# EAGLE design SensorTile_CR2032_V01 (EAGLE 8.6.0)
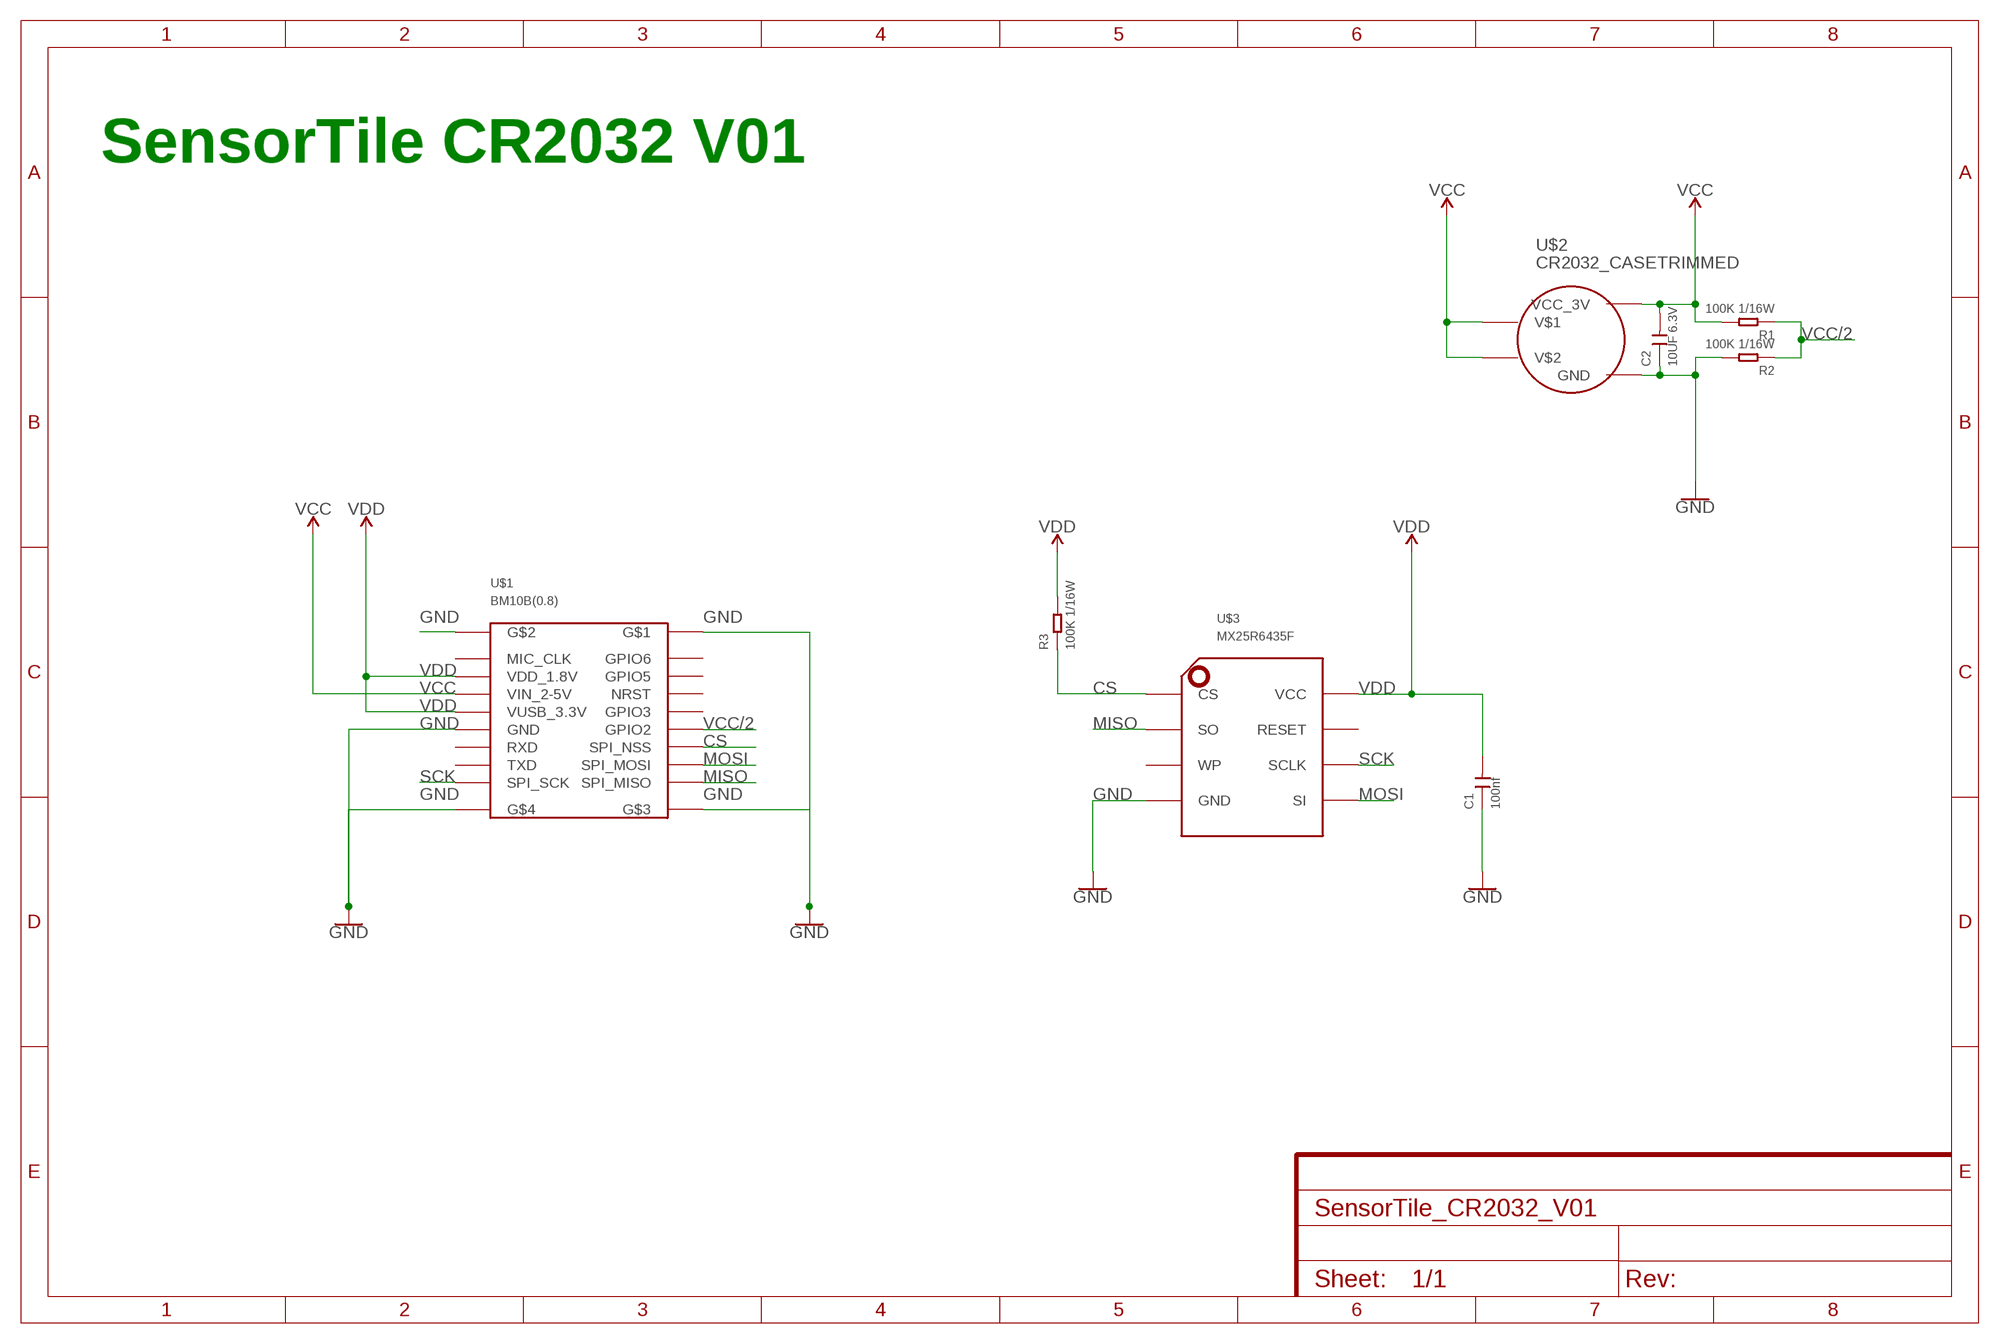
[diagram p0: schematic, sheet 1]

## Parts
C1  100nf  CERAMIC-100NF-25V-10%-X7R(0402)  [C0402]
C2  10UF 6.3V  CERAMIC-10UF-6.3V-20%-X5R(0603)  [C0603]
R1  100K 1/16W  SMD-RES-100K-5%-1/16W(0402)  [R0402]
R2  100K 1/16W  SMD-RES-100K-5%-1/16W(0402)  [R0402]
R3  100K 1/16W  SMD-RES-10K-1%-1/16W(0402)  [R0402]
U$1  BM10B(0.8)  BM10B(0.8)-16DP-0.4V(51)  [BM10B(0.8)-16DP-0.4V(51)]
U$2  CR2032_CASETRIMMED  [CR2032_CASE_TRIMMED]
U$3  MX25R6435F  [8-USON_MX25R6435F]

## Nets
CS: R3.1 U$1.SPI_NSS U$3.CS$1(CS)
GND: C1.1 C2.1 R2.2 U$1.G$1 U$1.G$2 U$1.G$3 U$1.G$4 U$1.GND$1(GND) U$2.GND U$3.GND$4(GND)
MISO: U$1.SPI_MISO U$3.SO$2(SO)
MOSI: U$1.SPI_MOSI U$3.SI$5(SI)
SCK: U$1.SPI_SCK U$3.SCLK$6(SCLK)
VCC: C2.2 R1.2 U$1.VIN_2-5V U$2.VCC@1(V$1) U$2.VCC@2(V$2) U$2.VCC_3V
VCC/2: R1.1 R2.1 U$1.GPIO2
VDD: C1.2 R3.2 U$1.VDD_1.8V U$1.VUSB_3.3V U$3.VCC$8(VCC)
Unconnected: U$1.GPIO3 U$1.GPIO5 U$1.GPIO6 U$1.MIC_CLK U$1.NRST U$1.RXD U$1.TXD U$3.RESET$7(RESET) U$3.WP$3(WP)

## Notes on the sheet
- SensorTile CR2032 V01

## Library data of the parts
C1 = Seeed-Capacitor-2016:CERAMIC-100NF-25V-10%-X7R(0402): 302010024; MPN: CC0402KRX7R8BB104
C2 = Seeed-Capacitor-2016:CERAMIC-10UF-6.3V-20%-X5R(0603): 302010286; MPN: CC0603MRX5R5BB106
R1 R2 = Seeed-Resistor-2016:SMD-RES-100K-5%-1/16W(0402): 301010033; MPN: RC0402JR-07100KL
R3 = Seeed-Resistor-2016:SMD-RES-10K-1%-1/16W(0402): 301010047; MPN: RC0402FR-0710KL; VALUE: 10K 1/16W
U$1 = BM10B(0.8):BM10B(0.8)-16DP-0.4V(51)
U$2 = CR2032:CR2032_CASE: CR2032_Case Digikey:‏‎BK-915-CT-ND‎‏
U$3 = MX25R6435F:MX25R6435F: MX25R6435F Digikey: ‎1092-1173-ND‎‏

## Board
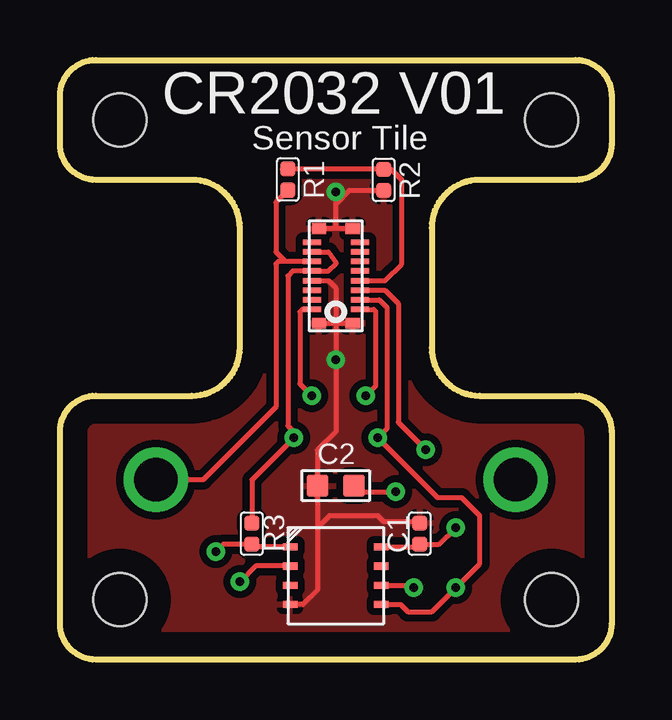
[diagram p1: board, top side]
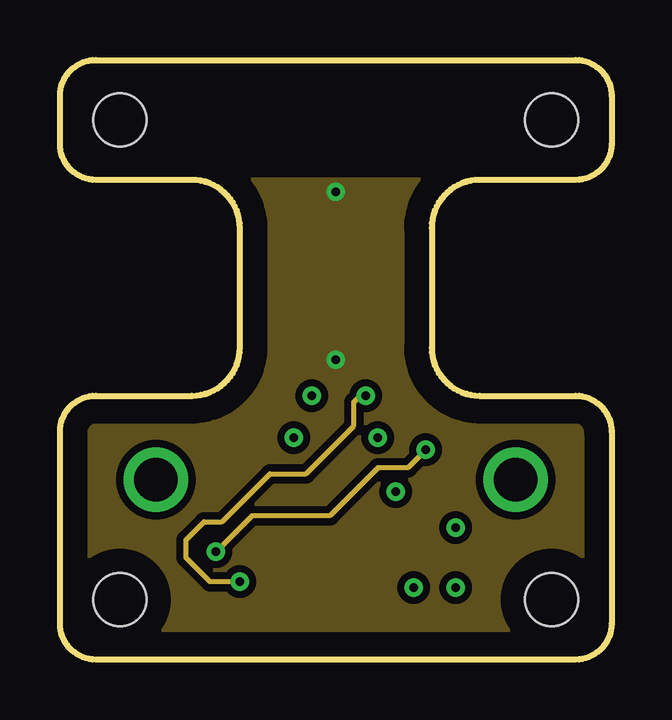
[diagram p2: board, inner layer Route2]
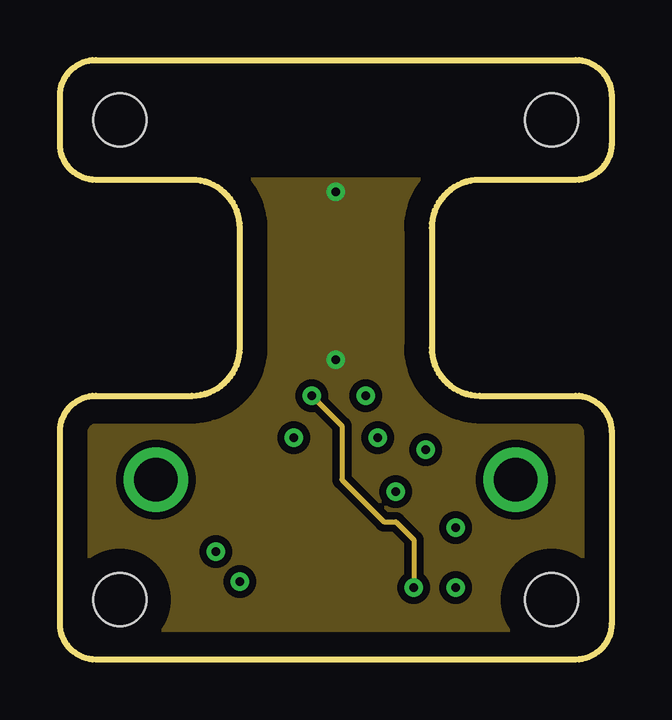
[diagram p3: board, inner layer Route15]
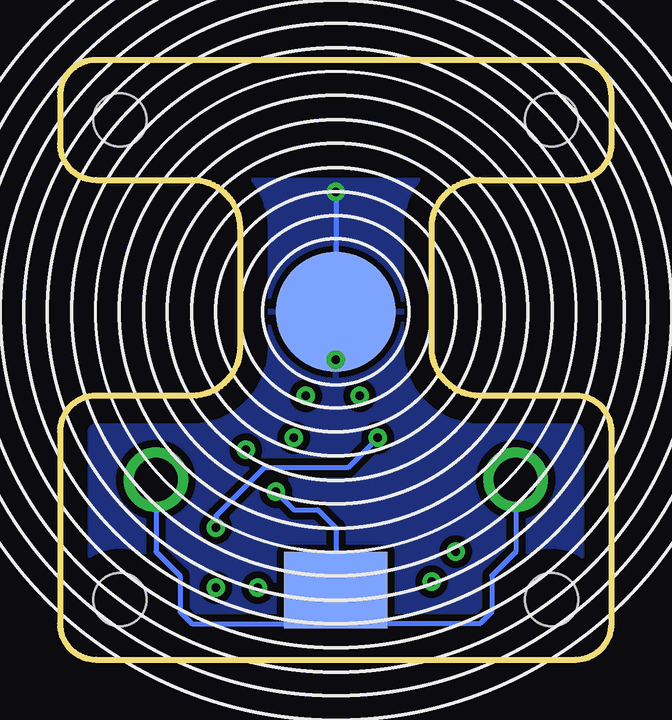
[diagram p4: board, bottom side, seen from below]

Size 23 x 25 mm. Coordinates in mm from the lower left corner, seen from the top.
Outline: 23,1.5 arc-90 21.5,0 1.5,0 arc-90 0,1.5 0,9.5 arc-90 1.5,11 5.5,11 arc90 7.5,13 7.5,18 arc90 5.5,20 1.5,20 arc-90 0,21.5 0,23.5 arc-90 1.5,25 21.5,25 arc-90 23,23.5 23,21.5 arc-90 21.5,20 17.5,20 arc90 15.5,18 15.5,13 arc90 17.5,11 21.5,11 arc-90 23,9.5 23,1.5
Copper layers (1*2+15*16): Top 0.035mm / dielectric 1.5mm / Route2 0.035mm / dielectric 0.15mm / Route15 0.035mm / dielectric 0.2mm / Bottom 0.035mm
Design rules "default *": minimum track width 6mil, minimum drill 0.35mm, track to track 6mil, track to pad 6mil, pad to pad 6mil, via to via 6mil, smd to smd 6mil, copper to edge 40mil, drill to drill 6mil, minimum pad ring 10mil, minimum via ring 8mil, stop-mask expansion 4mil, vias tented up to drill 0mil, thermal gap 10mil
Holes 2.2 mm at 20.5,2.5 2.5,2.5 2.5,22.5 20.5,22.5

### Footprints (pad centres in the part's own frame; a part is rotated, then mirrored left to right if it is on the bottom)
C0402 = smd 0.635 x 0.635: 1 0,0.445; 2 0,-0.445
C0603 = smd 0.889 x 0.889: 1 0,0.762; 2 0,-0.762
R0402 = smd 0.635 x 0.635: 1 0,0.445; 2 0,-0.445
BM10B(0.8)-16DP-0.4V(51) = smd 0.6 x 0.44: G$1 0.7,3.37; G$2 -0.7,3.37; G$3 0.7,-0.57; G$4 -0.7,-0.57 | smd 0.75 x 0.23: GND$1 -1,1.2; GPIO2 1,1.2; GPIO3 1,1.6; GPIO5 1,2.4; GPIO6 1,2.8; MIC_CLK -1,2.8; NRST 1,2; RXD -1,0.8; SPI_MISO 1,0; SPI_MOSI 1,0.4; SPI_NSS 1,0.8; SPI_SCK -1,0; TXD -1,0.4; VDD_1.8V -1,2.4; VIN_2-5V -1,2; VUSB_3.3V -1,1.6
CR2032_CASE_TRIMMED = smd 5 x 5: GND 0,10 | drill 1.8: VCC@1 7.5,3; VCC@2 -7.5,3 | smd 4.3 x 3.2: VCC_3V 0,-1.6
8-USON_MX25R6435F = smd 0.6 x 0.3: CS$1 -1.9,1.2; GND$4 -1.9,-1.2; RESET$7 1.9,0.4; SCLK$6 1.9,-0.4; SI$5 1.9,-1.2; SO$2 -1.9,0.4; VCC$8 1.9,1.2; WP$3 -1.9,-0.4

### Placement (x,y rotation side)
C1  15,5.25 0 top
C2  11.5,7.25 90 top
R1  9.5,20.02 0 top
R2  13.5,20 0 top
R3  8,5.25 180 top
U$1  11.5,14.6 0 top
U$2  11.5,4.5 0 bottom
U$3  11.5,3.5 0 top

### Tracks (layer width: path | path; a pad name or v marks a point on that pad's centre or on a via)
CS  (via drill 0.35)
  Top 0.203: U$1.SPI_NSS 13.55,15.4 14.11,14.84 14.11,9.89 v15.25,8.75 | v6.5,4.5 6.81,4.81 R3.1 8.11,4.7 U$3.CS$1
  Route2 0.203: v15.25,8.75 14.5,8 13.25,8 11.25,6 8,6 v6.5,4.5
GND  (via drill 0.35)
  Top 0.203: U$1.G$1 11.5,17.97 | 11.5,17.97 U$1.G$2 | U$1.G$4 11.5,14.03 | 11.5,14.03 U$1.G$3 | 11.5,17.97 11.5,19 | 11.5,19 v11.5,19.5 | U$1.GND$1 11.2,15.8 11.5,15.5 11.5,14.03 | 11.5,14.03 v11.5,12.5 11.5,9.5 10.74,8.74 C2.1 10.74,5.5 | U$3.GND$4 10.14,2.3 10.74,2.9 10.74,5.5 | R2.2 12.06,19.55 11.5,19 | C1.1 14.94,5.75 13.5,5.75 13.25,6 11.24,6 10.74,5.5
  Bottom 0.203: v11.5,19.5 U$2.GND v11.5,12.5
  pour Top (isolate 0.305): 23,0 23,20 0,20 0,0
  pour Bottom (isolate 0.305): 23,0 23,20 0,20 0,0
  pour Route2 (isolate 0.305): 23,0 23,20 0,20 0,0
  pour Route15 (isolate 0.305): 23,0 23,20 0,20 0,0
MISO  (via drill 0.35)
  Top 0.203: U$1.SPI_MISO 13.08,14.6 13.16,14.52 13.16,11.41 v12.75,11 | U$3.SO$2 8.15,3.9 v7.5,3.25
  Route2 0.203: v7.5,3.25 6.25,3.25 5.25,4.25 5.25,5 6,5.75 6.75,5.75 8.75,7.75 10.25,7.75 12.25,9.75 12.25,10.75 12.5,11 v12.75,11
MOSI  (via drill 0.35)
  Top 0.203: U$1.SPI_MOSI 13.31,15 13.63,14.68 13.63,9.63 v13.25,9.25 15.75,6.75 16.75,6.75 17.5,6 17.5,4 v16.5,3 15.5,2 14.5,2 14.2,2.3 U$3.SI$5
SCK  (via drill 0.35)
  Top 0.203: U$1.SPI_SCK 10.1,14.6 10,14.5 10,11.5 v10.5,11 | U$3.SCLK$6 14.65,3.1 v14.75,3
  Route15 0.203: v10.5,11 11.75,9.75 11.75,7.5 13.5,5.75 14,5.75 14.75,5 v14.75,3
VCC  (via drill 0.35)
  Top 0.203: U$1.VIN_2-5V 9.4,16.6 | 9.4,16.6 9.1,16.6 9,16.5 9,10.52 5.98,7.5 U$2.VCC@1 | R1.2 9,19.07 9,17 9.4,16.6 | C2.2 12.51,7 v14,7
  Bottom 0.203: U$2.VCC@2 19,4.5 18,3.5 18,2 17.5,1.5 12.9,1.5 U$2.VCC_3V | U$2.VCC@1 4,4.5 5,3.5 5,2 5.5,1.5 10.1,1.5 U$2.VCC_3V | 11.5,4.25 U$2.VCC_3V | v14,7 13.25,6.25 12.25,6.25 11.5,5.5 U$2.VCC_3V
VCC/2
  Top 0.203: R1.1 9.27,20.45 R2.1 13.81,20.45 14.25,20 14.25,16.5 13.55,15.8 U$1.GPIO2
VDD  (via drill 0.35)
  Top 0.203: U$1.VDD_1.8V 11.19,17 11.5,16.56 11.5,16.5 11.2,16.2 U$1.VUSB_3.3V 9.7,16.2 9.5,16 9.5,9.75 9.75,9.5 v9.75,9.25 8,7.5 R3.2 | U$3.VCC$8 14.89,4.7 C1.2 15.81,4.81 v16.5,5.5
  Bottom 0.203: v9.75,9.25 11,8 14.5,8 16.5,6 v16.5,5.5

### Text on the board
tPlace: CR2032 V01 | Sensor Tile